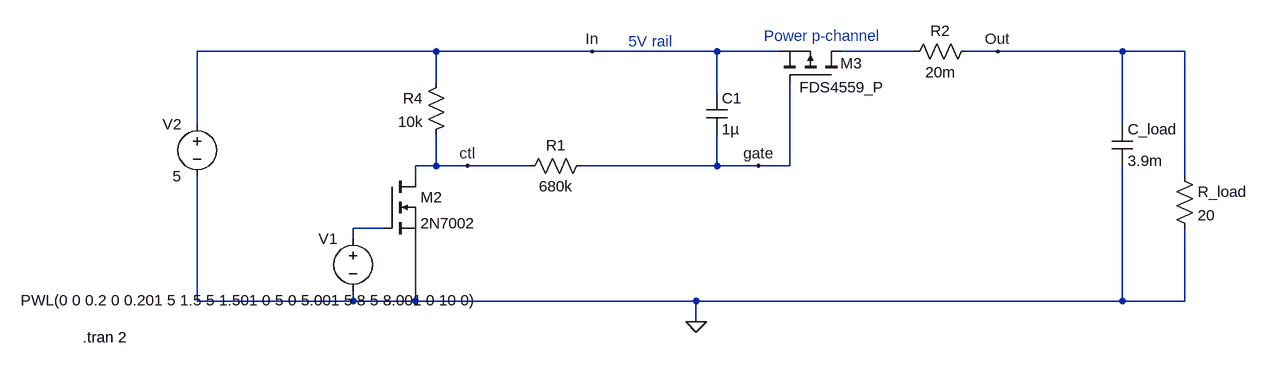
[diagram p0: schematic slow-start-circuit-1fet.asc]
slow-start-circuit-1fet.asc, the LTspice schematic file:
Version 4
SHEET 1 1448 680
WIRE 192 112 -176 112
WIRE 432 112 192 112
WIRE 624 112 432 112
WIRE 720 112 624 112
WIRE 928 112 816 112
WIRE 1056 112 1008 112
WIRE 1248 112 1056 112
WIRE 1344 112 1248 112
WIRE 192 160 192 112
WIRE 624 176 624 112
WIRE -176 224 -176 112
WIRE 1248 224 1248 112
WIRE 192 288 192 240
WIRE 192 288 160 288
WIRE 240 288 192 288
WIRE 336 288 240 288
WIRE 624 288 624 240
WIRE 624 288 416 288
WIRE 688 288 624 288
WIRE 736 288 736 160
WIRE 736 288 688 288
WIRE 160 304 160 288
WIRE 1344 304 1344 112
WIRE 112 384 64 384
WIRE 64 400 64 384
WIRE -176 496 -176 304
WIRE 64 496 64 480
WIRE 64 496 -176 496
WIRE 160 496 160 400
WIRE 160 496 64 496
WIRE 592 496 160 496
WIRE 1248 496 1248 288
WIRE 1248 496 592 496
WIRE 1344 496 1344 384
WIRE 1344 496 1248 496
WIRE 592 528 592 496
FLAG 592 528 0
FLAG 1056 112 Out
FLAG 432 112 In
FLAG 240 288 ctl
FLAG 688 288 gate
SYMBOL voltage 64 384 M0
WINDOW 123 0 0 Left 0
WINDOW 39 0 0 Left 0
WINDOW 3 -198 111 Left 2
SYMATTR Value PWL(0 0 0.2 0 0.201 5 1.5 5 1.501 0 5 0 5.001 5 8 5 8.001 0 10 0)
SYMATTR InstName V1
SYMBOL voltage -176 208 M0
WINDOW 123 0 0 Left 0
WINDOW 39 0 0 Left 0
SYMATTR InstName V2
SYMATTR Value 5
SYMBOL res 1328 288 R0
SYMATTR InstName R_load
SYMATTR Value 20
SYMBOL nmos 112 304 R0
SYMATTR InstName M2
SYMATTR Value 2N7002
SYMBOL pmos 816 160 M270
WINDOW 0 30 2 VLeft 2
WINDOW 3 -7 65 VLeft 2
SYMATTR InstName M3
SYMATTR Value FDS4559_P
SYMBOL res 208 144 M0
SYMATTR InstName R4
SYMATTR Value 10k
SYMBOL cap 608 176 R0
SYMATTR InstName C1
SYMATTR Value 1µ
SYMBOL cap 1232 224 R0
SYMATTR InstName C_load
SYMATTR Value 3.9m
SYMBOL res 432 272 R90
WINDOW 0 0 56 VBottom 2
WINDOW 3 32 56 VTop 2
SYMATTR InstName R1
SYMATTR Value 680k
SYMBOL res 1024 96 R90
WINDOW 0 0 56 VBottom 2
WINDOW 3 32 56 VTop 2
SYMATTR InstName R2
SYMATTR Value 20m
TEXT -352 552 Left 2 !.tran 2
TEXT 488 96 Left 2 ;5V rail
TEXT 696 88 Left 2 ;Power p-channel

The netlist it stands for:
* slow-start-circuit-1fet.asc
V1 N002 0 PWL(0 0 0.2 0 0.201 5 1.5 5 1.501 0 5 0 5.001 5 8 5 8.001 0 10 0)
V2 In 0 5
R_load Out 0 20
M2 ctl N002 0 0 2N7002
M3 N001 gate In In FDS4559_P
R4 In ctl 10k
C1 In gate 1µ
C_load Out 0 3.9m
R1 gate ctl 680k
R2 Out N001 20m
.model NMOS NMOS
.model PMOS PMOS
.lib standard.mos
.tran 2
* 5V rail
* Power p-channel
.backanno
.end

* Results of the author's LTspice run, read from the files saved beside the schematic
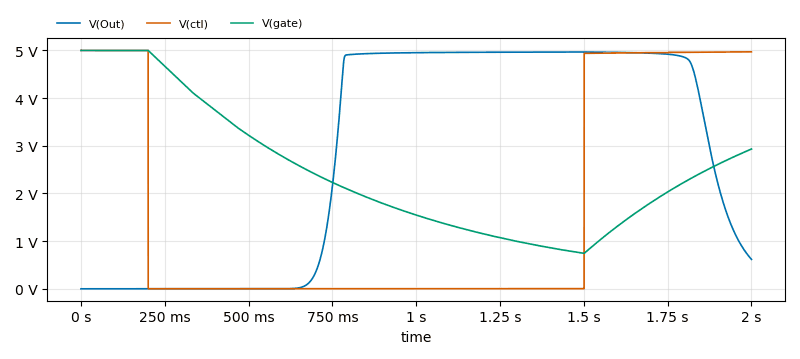
[diagram p1: Transient Analysis of slow-start-circuit-1fet.asc, plotted from the saved traces]
* Transient Analysis, 1 run:
*   V(Out): min 0 V, max 4.966 V, average 2.853 V, rms 3.678 V, last 616.4 mV
*   V(ctl): min 1.069 mV, max 5.001 V, average 1.739 V, rms 2.939 V, last 4.97 V
*   V(gate): min 741.9 mV, max 5 V, average 2.445 V, rms 2.786 V, last 2.932 V